# EAGLE design imu (EAGLE 5.02)
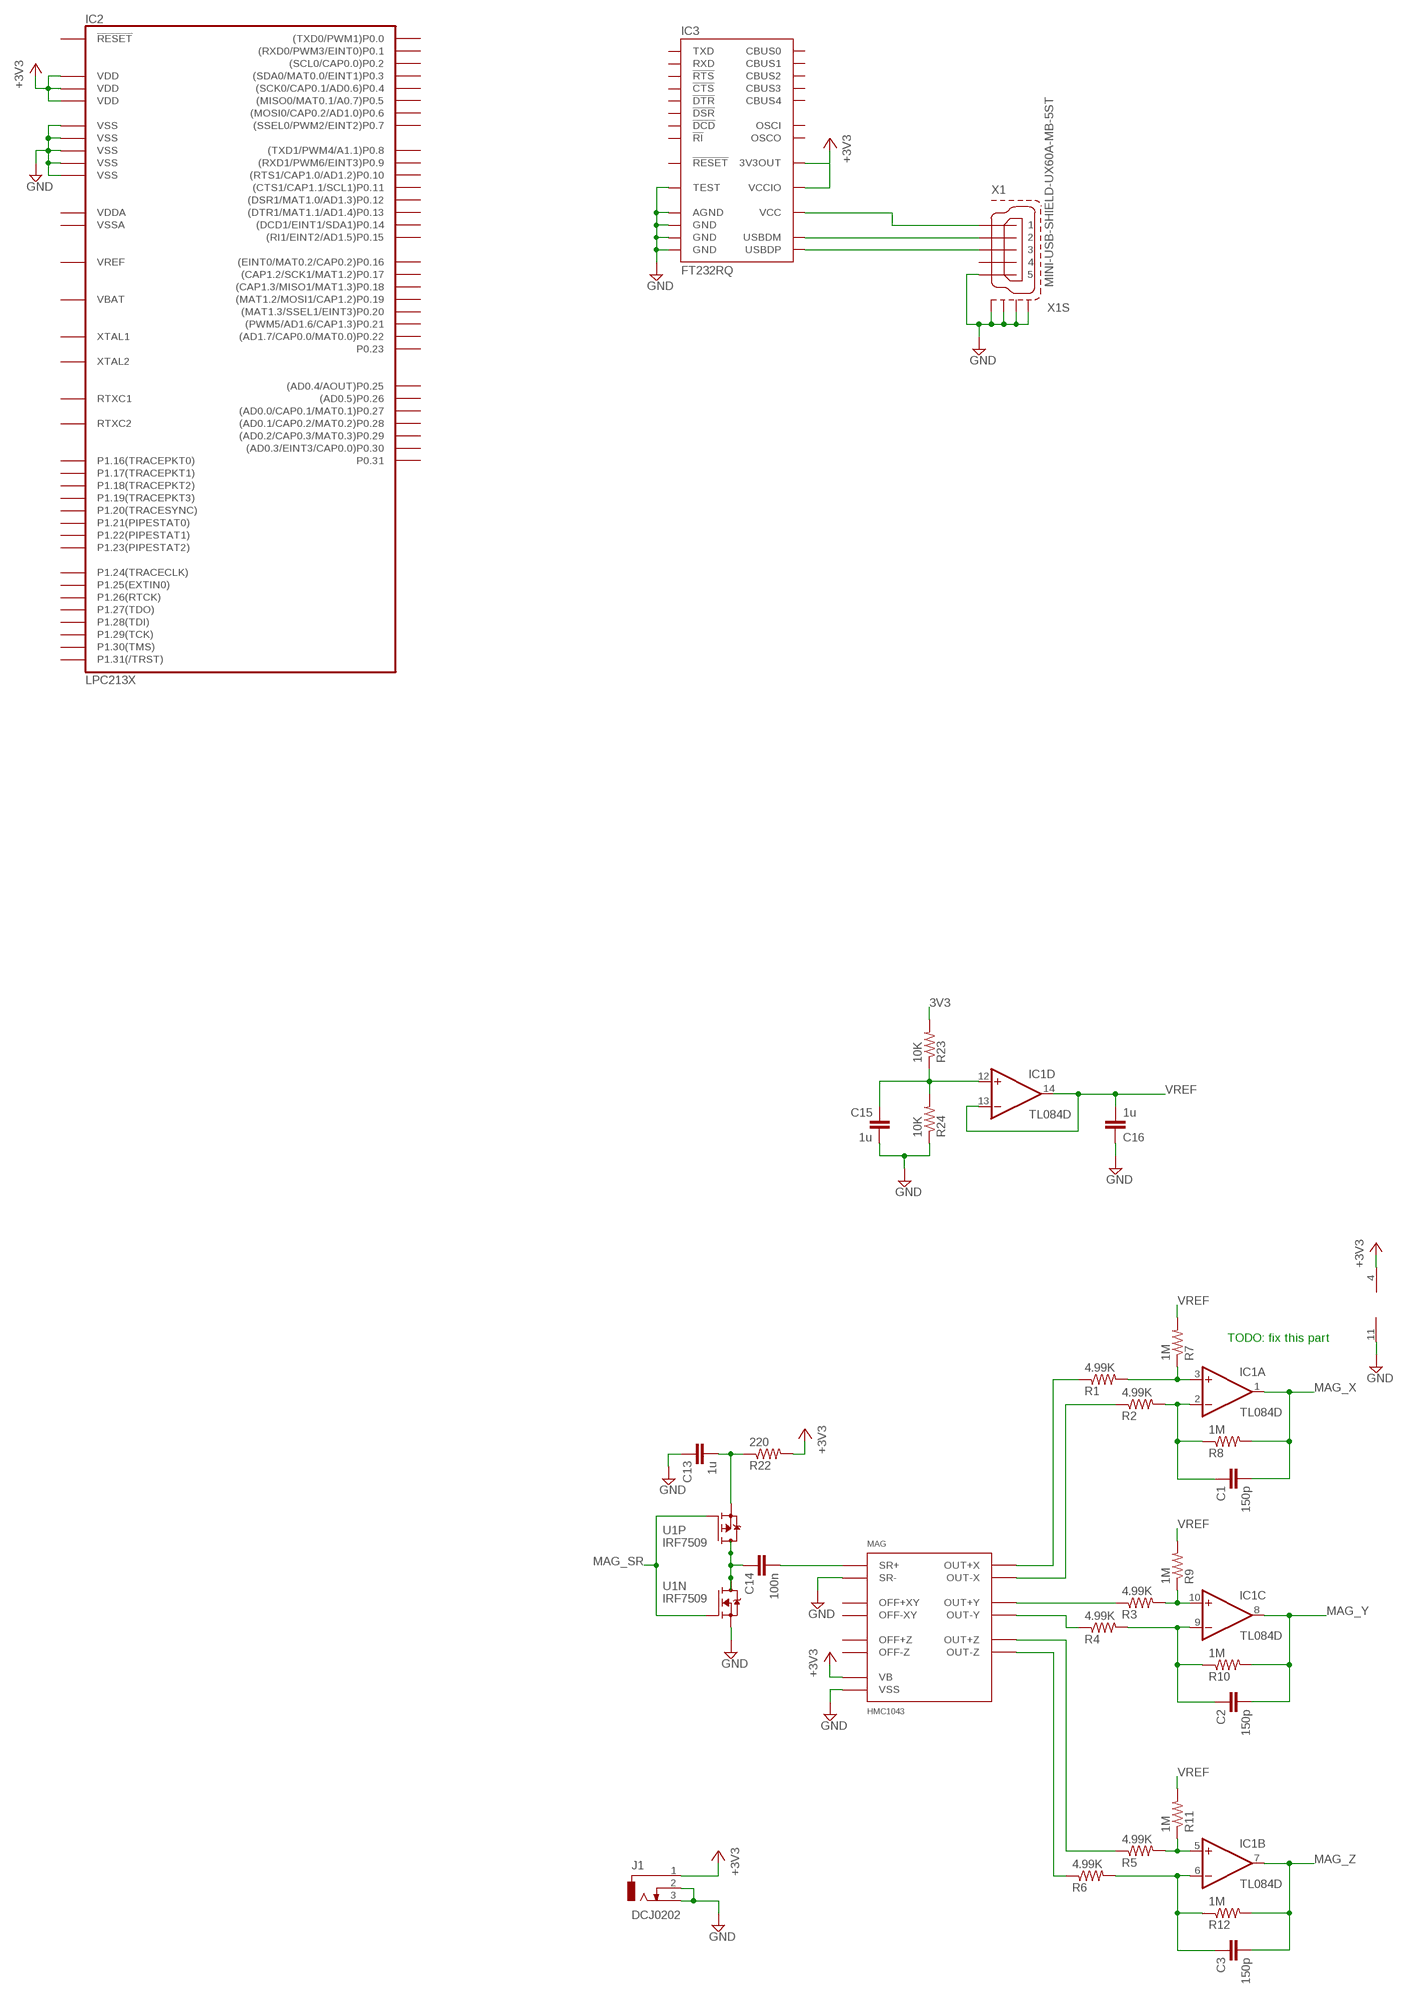
[diagram p0: schematic, sheet 1, part 1 of 2]
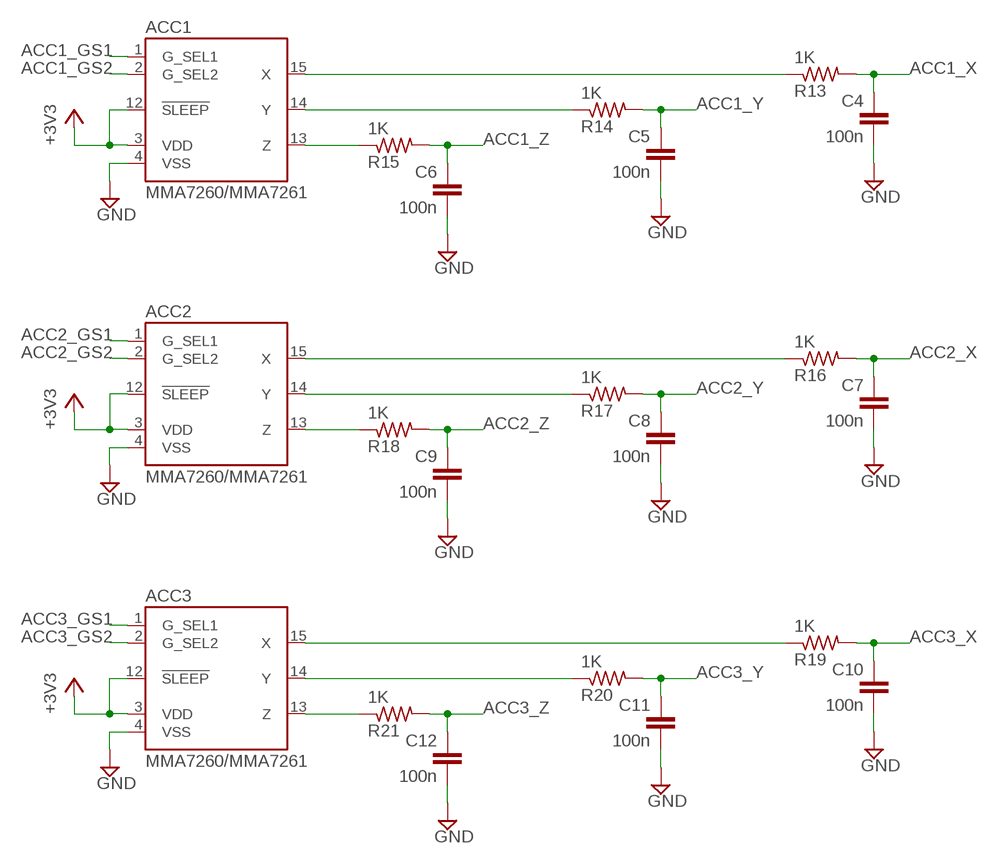
[diagram p1: schematic, sheet 1, part 2 of 2]

## Parts
ACC1  MMA7260/MMA7261  [QFN16-HS]
ACC2  MMA7260/MMA7261  [QFN16-HS]
ACC3  MMA7260/MMA7261  [QFN16-HS]
C1  150p  C-EUC0603  [C0603]
C2  150p  C-EUC0603  [C0603]
C3  150p  C-EUC0603  [C0603]
C4  100n  C-EUC0603  [C0603]
C5  100n  C-EUC0603  [C0603]
C6  100n  C-EUC0603  [C0603]
C7  100n  C-EUC0603  [C0603]
C8  100n  C-EUC0603  [C0603]
C9  100n  C-EUC0603  [C0603]
C10  100n  C-EUC0603  [C0603]
C11  100n  C-EUC0603  [C0603]
C12  100n  C-EUC0603  [C0603]
C13  1u  C-EUC0603  [C0603]
C14  100n  C-EUC0603  [C0603]
C15  1u  C-EUC0603  [C0603]
C16  1u  C-EUC0603  [C0603]
IC1  TL084D  [SO14]
IC2  LPC213X  [LQFP64]
IC3  FT232RQ  [QFN32]
J1  DCJ0202  [DCJ0202]
MAG  HMC1043  [16-PIN_LPCC]
R1  4.99K  R-US_R0603  [R0603]
R2  4.99K  R-US_R0603  [R0603]
R3  4.99K  R-US_R0603  [R0603]
R4  4.99K  R-US_R0603  [R0603]
R5  4.99K  R-US_R0603  [R0603]
R6  4.99K  R-US_R0603  [R0603]
R7  1M  R-US_R0603  [R0603]
R8  1M  R-US_R0603  [R0603]
R9  1M  R-US_R0603  [R0603]
R10  1M  R-US_R0603  [R0603]
R11  1M  R-US_R0603  [R0603]
R12  1M  R-US_R0603  [R0603]
R13  1K  R-US_R0603  [R0603]
R14  1K  R-US_R0603  [R0603]
R15  1K  R-US_R0603  [R0603]
R16  1K  R-US_R0603  [R0603]
R17  1K  R-US_R0603  [R0603]
R18  1K  R-US_R0603  [R0603]
R19  1K  R-US_R0603  [R0603]
R20  1K  R-US_R0603  [R0603]
R21  1K  R-US_R0603  [R0603]
R22  220  R-US_R0603  [R0603]
R23  10K  R-US_R0603  [R0603]
R24  10K  R-US_R0603  [R0603]
U1  IRF7509  [MICRO8]
X1  MINI-USB-SHIELD-UX60A-MB-5ST  [UX60A-MB-5ST]

## Nets
3V3: R23.2
+3V3: ACC1.3(VDD) ACC1.12(!SLEEP) ACC2.3(VDD) ACC2.12(!SLEEP) ACC3.3(VDD) ACC3.12(!SLEEP) IC1.4(P:V+) IC2.23(VDD) IC2.43(VDD) IC2.51(VDD) IC3.1(VCCIO) IC3.16(3V3OUT) J1.1 MAG.12(VB) R22.2
+5V_USB: IC3.19(VCC) X1.1
ACC1_GS1: ACC1.1(G_SEL1)
ACC1_GS2: ACC1.2(G_SEL2)
ACC1_X: C4.1 R13.2
ACC1_Y: C5.1 R14.2
ACC1_Z: C6.1 R15.2
ACC2_GS1: ACC2.1(G_SEL1)
ACC2_GS2: ACC2.2(G_SEL2)
ACC2_X: C7.1 R16.2
ACC2_Y: C8.1 R17.2
ACC2_Z: C9.1 R18.2
ACC3_GS1: ACC3.1(G_SEL1)
ACC3_GS2: ACC3.2(G_SEL2)
ACC3_X: C10.1 R19.2
ACC3_Y: C11.1 R20.2
ACC3_Z: C12.1 R21.2
GND: ACC1.4(VSS) ACC2.4(VSS) ACC3.4(VSS) C4.2 C5.2 C6.2 C7.2 C8.2 C9.2 C10.2 C11.2 C12.2 C13.1 C15.2 C16.1 IC1.11(P:V-) IC2.6(VSS) IC2.18(VSS) IC2.25(VSS) IC2.42(VSS) IC2.50(VSS) IC3.4(GND) IC3.17(GND) IC3.20(GND) IC3.24(AGND) IC3.26(TEST) J1.2 J1.3 MAG.2(VSS) MAG.7(SR-) R24.1 U1.1(N:S) X1.5 X1.M1(S1) X1.M2(S2) X1.M3(S3) X1.M4(S4)
MAG_SR: U1.2(N:G) U1.4(P:G)
MAG_X: C1.2 IC1.1(A:OUT) R8.2
MAG_Y: C2.2 IC1.8(C:OUT) R10.2
MAG_Z: C3.2 IC1.7(B:OUT) R12.2
N$1: ACC1.14(Y) R14.1
N$2: ACC2.15(X) R16.1
N$3: ACC1.15(X) R13.1
N$4: ACC2.13(Z) R18.1
N$5: ACC1.13(Z) R15.1
N$6: C2.1 IC1.9(C:-IN) R4.2 R10.1
N$7: C14.1 U1.5(P:D) U1.6(P:D) U1.7(N:D) U1.8(N:D)
N$8: ACC2.14(Y) R17.1
N$9: ACC3.15(X) R19.1
N$10: ACC3.13(Z) R21.1
N$11: ACC3.14(Y) R20.1
N$12: IC1.10(C:+IN) R3.2 R9.1
N$13: C3.1 IC1.6(B:-IN) R6.2 R12.1
N$14: IC3.15(USBDM) X1.2
N$15: IC1.5(B:+IN) R5.2 R11.1
N$16: C1.1 IC1.2(A:-IN) R2.2 R8.1
N$17: IC3.14(USBDP) X1.3
N$18: IC1.3(A:+IN) R1.2 R7.1
N$19: MAG.3(OUT+X) R1.1
N$20: MAG.15(OUT-X) R2.1
N$21: MAG.11(OUT+Z) R5.1
N$22: MAG.10(OUT-Z) R6.1
N$23: MAG.6(OUT+Y) R3.1
N$24: MAG.1(OUT-Y) R4.1
N$26: C14.2 MAG.5(SR+)
N$27: C13.2 R22.1 U1.3(P:S)
N$30: C15.1 IC1.12(D:+IN) R23.1 R24.2
VREF: C16.2 IC1.13(D:-IN) IC1.14(D:OUT) R7.2 R9.2 R11.2
Unconnected: IC2.1((PWM5/AD1.6/CAP1.3)P0.21) IC2.2((AD1.7/CAP0.0/MAT0.0)P0.22) IC2.3(RTXC1) IC2.4(P1.19(TRACEPKT3)) IC2.5(RTXC2) IC2.8(P1.18(TRACEPKT2)) IC2.9((AD0.4/AOUT)P0.25) IC2.10((AD0.5)P0.26) IC2.11((AD0.0/CAP0.1/MAT0.1)P0.27) IC2.12(P1.17(TRACEPKT1)) IC2.13((AD0.1/CAP0.2/MAT0.2)P0.28) IC2.14((AD0.2/CAP0.3/MAT0.3)P0.29) IC2.15((AD0.3/EINT3/CAP0.0)P0.30) IC2.16(P1.16(TRACEPKT0)) IC2.17(P0.31) IC2.19((TXD0/PWM1)P0.0) IC2.20(P1.31(/TRST)) IC2.21((RXD0/PWM3/EINT0)P0.1) IC2.22((SCL0/CAP0.0)P0.2) IC2.24(P1.26(RTCK)) IC2.26((SDA0/MAT0.0/EINT1)P0.3) IC2.27((SCK0/CAP0.1/AD0.6)P0.4) IC2.28(P1.25(EXTIN0)) IC2.29((MISO0/MAT0.1/A0.7)P0.5) IC2.30((MOSI0/CAP0.2/AD1.0)P0.6) IC2.31((SSEL0/PWM2/EINT2)P0.7) IC2.32(P1.24(TRACECLK)) IC2.33((TXD1/PWM4/A1.1)P0.8) IC2.34((RXD1/PWM6/EINT3)P0.9) IC2.35((RTS1/CAP1.0/AD1.2)P0.10) IC2.36(P1.23(PIPESTAT2)) IC2.37((CTS1/CAP1.1/SCL1)P0.11) IC2.38((DSR1/MAT1.0/AD1.3)P0.12) IC2.39((DTR1/MAT1.1/AD1.4)P0.13) IC2.40(P1.22(PIPESTAT1)) IC2.41((DCD1/EINT1/SDA1)P0.14) IC2.44(P1.21(PIPESTAT0)) IC2.45((RI1/EINT2/AD1.5)P0.15) IC2.46((EINT0/MAT0.2/CAP0.2)P0.16) IC2.47((CAP1.2/SCK1/MAT1.2)P0.17) IC2.48(P1.20(TRACESYNC)) IC2.52(P1.30(TMS)) IC2.53((CAP1.3/MISO1/MAT1.3)P0.18) IC2.54((MAT1.2/MOSI1/CAP1.2)P0.19) IC2.55((MAT1.3/SSEL1/EINT3)P0.20) IC2.56(P1.29(TCK)) IC2.57(!RESET) IC2.58(P0.23) IC2.60(P1.28(TDI)) IC2.61(XTAL2) IC2.62(XTAL1) IC2.64(P1.27(TDO)) IC3.2(RXD) IC3.3(!RI) IC3.6(!DSR) IC3.7(!DCD) IC3.8(!CTS) IC3.9(CBUS4) IC3.10(CBUS2) IC3.11(CBUS3) IC3.18(!RESET) IC3.21(CBUS1) IC3.22(CBUS0) IC3.27(OSCI) IC3.28(OSCO) IC3.30(TXD) IC3.31(!DTR) IC3.32(!RTS) MAG.4(OFF-XY) MAG.13(OFF-Z) MAG.14(OFF+Z) MAG.16(OFF+XY) X1.4

## Notes on the sheet
- TODO: fix this part

## Power pins joined to a net without a drawn wire
VBAT: IC2.49(VBAT)
VDDA: IC2.7(VDDA)
VREF: IC2.63(VREF)
VSSA: IC2.59(VSSA)

## Library data of the parts
ACC1-ACC3 = mma7260_7261:MMA7260/MMA7261
C1-C16 = rcl:C-EU: CAPACITOR, European symbol
IC1 = linear:TL084: OP AMP
IC2 = lpc213x:LPC213X: LPC213x Schematic element and footprint for NXP LPC213x. Spark Fun Electronics SKU : COM-00520
IC3 = ft232r:FT232R: Source: http://www.ftdichip.com/Documents/DataSheets/DS_FT232R_v104.pdf
J1 = con-jack:DCJ0202: DC POWER JACK Source: DCJ0202.pdf
MAG = hmc1043:HMC1043
R1-R24 = rcl:R-US_: RESISTOR, American symbol
U1 = irf7509:IRF7509
X1 = con-hirose:MINI-USB-SHIELD-: MINI USB Connector Source: http://www.hirose.co.jp/cataloge_hp/e24000019.pdf

## Net classes
1 power: width 0.61 mm, drill 0.711 mm, clearance 0.33 mm
2 gnd: width 0.305 mm, drill 0.711 mm, clearance 0.254 mm
3 usbvcc: width 0.508 mm, drill 0.711 mm, clearance 0.254 mm
4 aref: width 0.406 mm

## Board
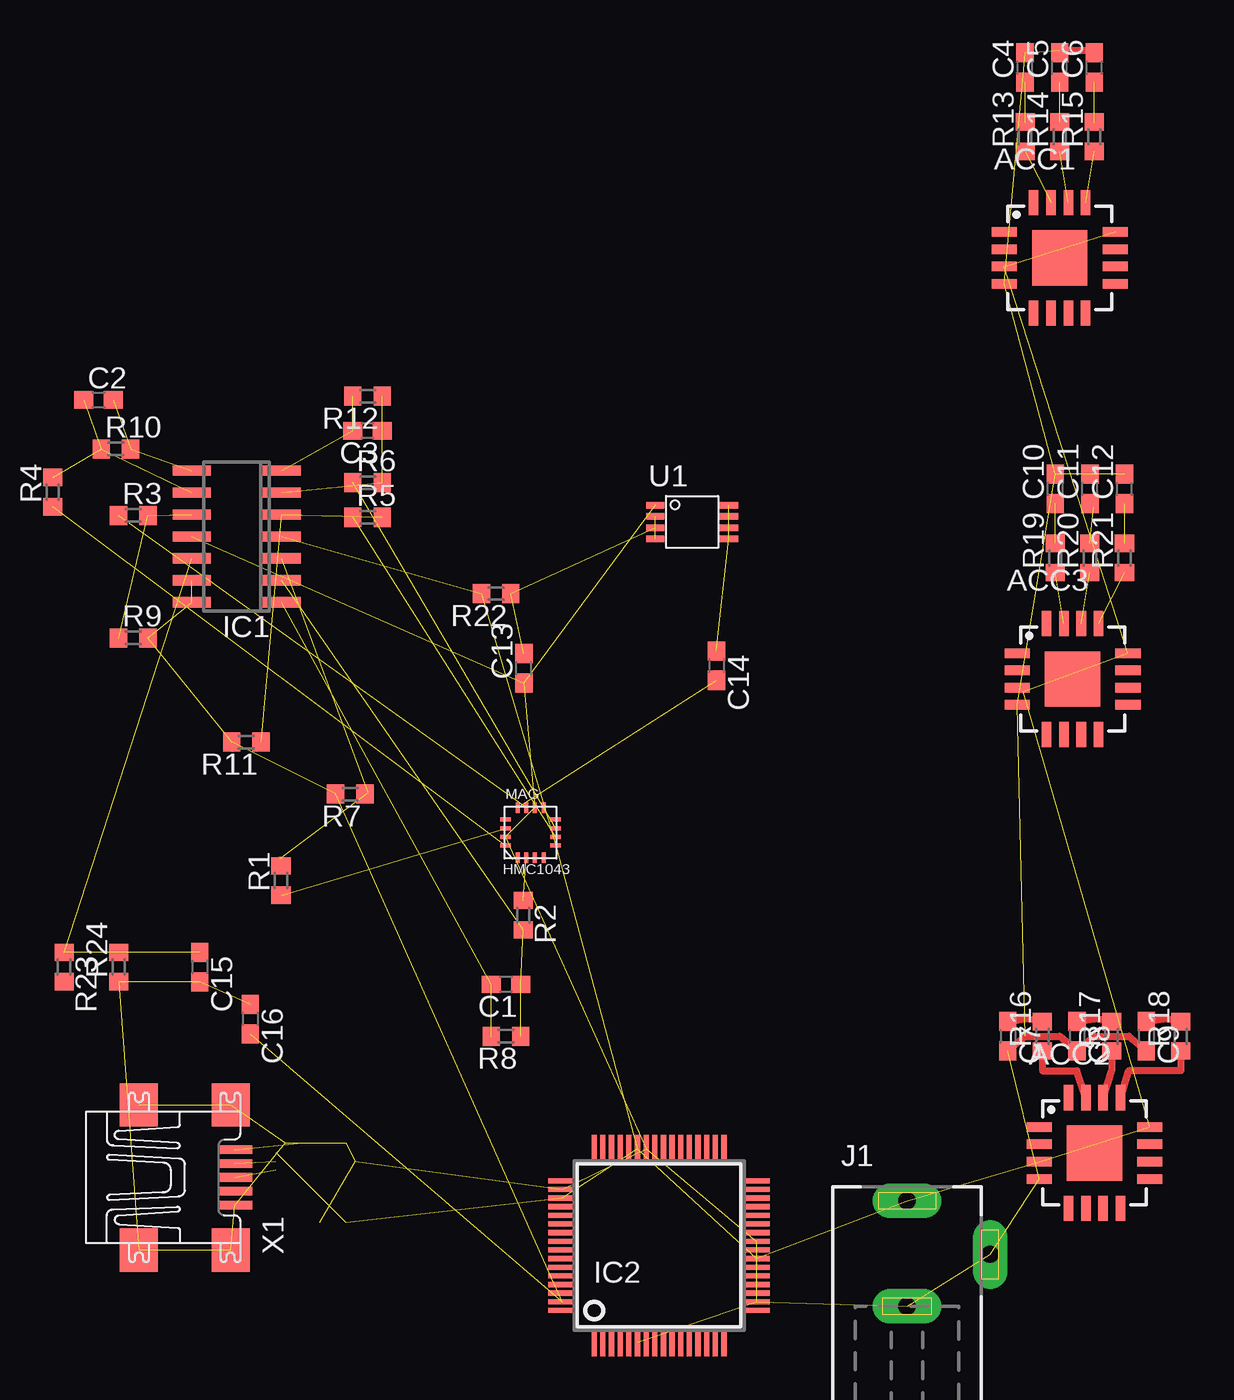
[diagram p2: board, top side]
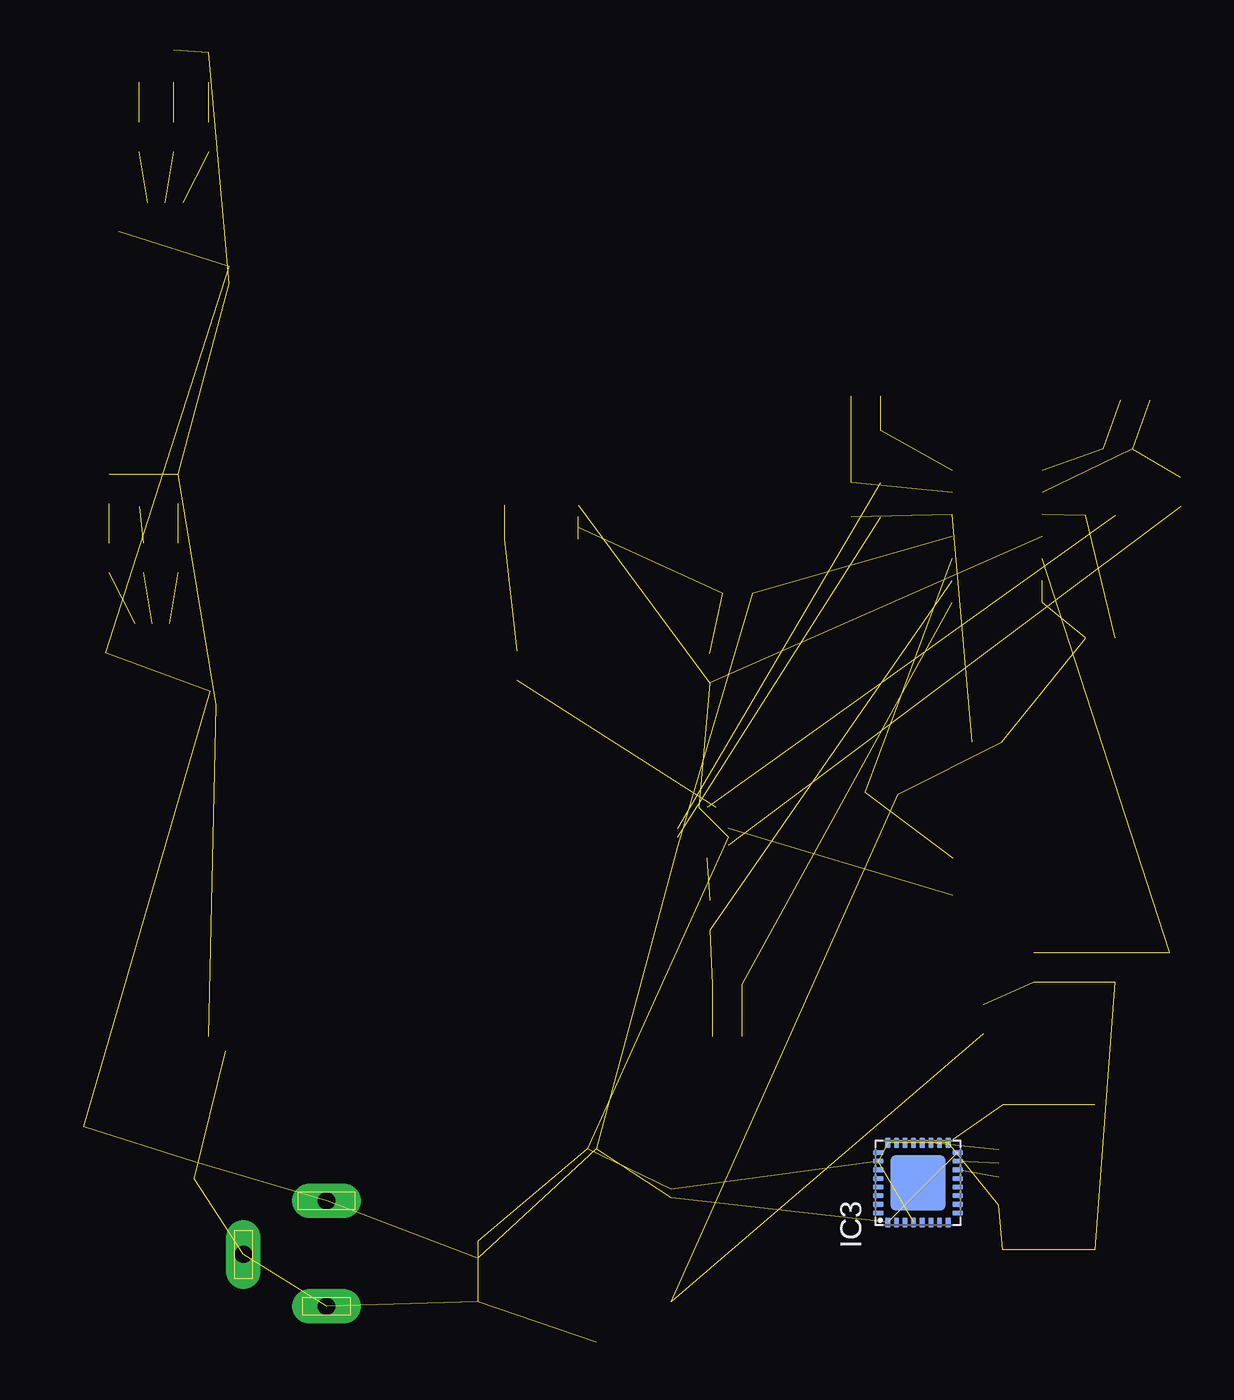
[diagram p3: board, bottom side, seen from below]

No outline drawn. Coordinates in mm, seen from the top.
Copper layers (1*16): Top 0.035mm / dielectric 1.5mm / Bottom 0.035mm
Design rules "default": minimum track width 10mil, minimum drill 24mil, track to track 8mil, track to pad 8mil, pad to pad 8mil, via to via 8mil, smd to smd 8mil, copper to edge 40mil, drill to drill 8mil, minimum pad ring 10mil, minimum via ring 8mil, stop-mask expansion 4mil, vias tented up to drill 0mil, thermal gap 10mil

### Footprints (pad centres in the part's own frame; a part is rotated, then mirrored left to right if it is on the bottom)
QFN16-HS = smd 1.45 x 0.55: 1 -3.2,1.5; 2 -3.2,0.5; 3 -3.2,-0.5; 4 -3.2,-1.5; 9 3.2,-1.5; 10 3.2,-0.5; 11 3.2,0.5; 12 3.2,1.5 | smd 0.55 x 1.45: 5 -1.5,-3.2; 6 -0.5,-3.2; 7 0.5,-3.2; 8 1.5,-3.2; 13 1.5,3.2; 14 0.5,3.2; 15 -0.5,3.2; 16 -1.5,3.2 | smd 3.2 x 3.2: 17 0,0
C0603 = smd 1.1 x 1: 1 -0.85,0; 2 0.85,0
SO14 = smd 0.6 x 2.2: 1 -3.81,-2.6; 2 -2.54,-2.6; 3 -1.27,-2.6; 4 0,-2.6; 5 1.27,-2.6; 6 2.54,-2.6; 7 3.81,-2.6; 8 3.81,2.6; 9 2.54,2.6; 10 1.27,2.6; 11 0,2.6; 12 -1.27,2.6; 13 -2.54,2.6; 14 -3.81,2.6
LQFP64 = smd 0.3 x 1.6: 1 -3.75,-5.6; 2 -3.25,-5.6; 3 -2.75,-5.6; 4 -2.25,-5.6; 5 -1.75,-5.6; 6 -1.25,-5.6; 7 -0.75,-5.6; 8 -0.25,-5.6; 9 0.25,-5.6; 10 0.75,-5.6; 11 1.25,-5.6; 12 1.75,-5.6; 13 2.25,-5.6; 14 2.75,-5.6; 15 3.25,-5.6; 16 3.75,-5.6; 33 3.75,5.6; 34 3.25,5.6; 35 2.75,5.6; 36 2.25,5.6; 37 1.75,5.6; 38 1.25,5.6; 39 0.75,5.6; 40 0.25,5.6; 41 -0.25,5.6; 42 -0.75,5.6; 43 -1.25,5.6; 44 -1.75,5.6; 45 -2.25,5.6; 46 -2.75,5.6; 47 -3.25,5.6; 48 -3.75,5.6 | smd 1.6 x 0.3: 17 5.6,-3.75; 18 5.6,-3.25; 19 5.6,-2.75; 20 5.6,-2.25; 21 5.6,-1.75; 22 5.6,-1.25; 23 5.6,-0.75; 24 5.6,-0.25; 25 5.6,0.25; 26 5.6,0.75; 27 5.6,1.25; 28 5.6,1.75; 29 5.6,2.25; 30 5.6,2.75; 31 5.6,3.25; 32 5.6,3.75; 49 -5.6,3.75; 50 -5.6,3.25; 51 -5.6,2.75; 52 -5.6,2.25; 53 -5.6,1.75; 54 -5.6,1.25; 55 -5.6,0.75; 56 -5.6,0.25; 57 -5.6,-0.25; 58 -5.6,-0.75; 59 -5.6,-1.25; 60 -5.6,-1.75; 61 -5.6,-2.25; 62 -5.6,-2.75; 63 -5.6,-3.25; 64 -5.6,-3.75
QFN32 = smd 0.6 x 0.3: 1 -2.3,1.75; 2 -2.3,1.25; 3 -2.3,0.75; 4 -2.3,0.25; 5 -2.3,-0.25; 6 -2.3,-0.75; 7 -2.3,-1.25; 8 -2.3,-1.75; 17 2.3,-1.75; 18 2.3,-1.25; 19 2.3,-0.75; 20 2.3,-0.25; 21 2.3,0.25; 22 2.3,0.75; 23 2.3,1.25; 24 2.3,1.75 | smd 0.3 x 0.6: 9 -1.75,-2.3; 10 -1.25,-2.3; 11 -0.75,-2.3; 12 -0.25,-2.3; 13 0.25,-2.3; 14 0.75,-2.3; 15 1.25,-2.3; 16 1.75,-2.3; 25 1.75,2.3; 26 1.25,2.3; 27 0.75,2.3; 28 0.25,2.3; 29 -0.25,2.3; 30 -0.75,2.3; 31 -1.25,2.3; 32 -1.75,2.3 | smd 3.2 x 3.2: EXP 0,0
DCJ0202 = drill 1 pad 2 long: 1 0,3.1; 2 4.8,0; 3 0,-3
16-PIN_LPCC = smd 0.6 x 0.23: 1 0.05,0.75; 2 0.05,1.25; 3 0.05,1.75; 4 0.05,2.25; 9 2.95,2.25; 10 2.95,1.75; 11 2.95,1.25; 12 2.95,0.75 | smd 0.23 x 0.6: 5 0.75,2.95; 6 1.25,2.95; 7 1.75,2.95; 8 2.25,2.95; 13 2.25,0.05; 14 1.75,0.05; 15 1.25,0.05; 16 0.75,0.05
R0603 = smd 1 x 1.1: 1 -0.85,0; 2 0.85,0
MICRO8 = smd 0.38 x 1.05: 1 -0.975,-2.125; 2 -0.325,-2.125; 3 0.325,-2.125; 4 0.975,-2.125; 5 0.975,2.125; 6 0.325,2.125; 7 -0.325,2.125; 8 -0.975,2.125
UX60A-MB-5ST = smd 2 x 0.5: 1 2.25,1.6; 2 2.25,0.8; 3 2.25,0; 4 2.25,-0.8; 5 2.25,-1.6 | smd 2.2 x 2.5: M1 -3.3,-4.2; M2 -3.3,4.2; M3 2,4.2; M4 2,-4.2

### Placement (x,y rotation side)
ACC1  59,69 0 top
ACC2  61.02,17.25 0 top
ACC3  59.75,44.65 0 top
C1  27,27 180 top
C2  3.46,60.79 0 top
C3  19,59 180 top
C4  57,80 90 top
C5  59,80 90 top
C6  61,80 90 top
C7  56,24 270 top
C8  60,24 270 top
C9  64,24 270 top
C10  58.75,55.65 90 top
C11  60.75,55.65 90 top
C12  62.75,55.65 90 top
C13  28.04,45.27 90 top
C14  39.16,45.43 270 top
C15  9.3,28 270 top
C16  12.22,25 270 top
IC1  11.43,52.89 90 top
IC2  35.85,11.9 0 top
IC3  16,15.53 90 bottom
J1  50.18,11.39 0 top
MAG  26.92,34.27 0 top
R1  14,33 90 top
R2  28,31 270 top
R3  5.46,54.11 0 top
R4  0.81,55.46 90 top
R5  19,54 0 top
R6  19,56 0 top
R7  18,38 180 top
R8  27,24 180 top
R9  5.46,47.03 0 top
R10  4.46,57.95 0 top
R11  12,41 180 top
R12  19,61 180 top
R13  57,76 90 top
R14  59,76 90 top
R15  61,76 90 top
R16  58,24 90 top
R17  62,24 90 top
R18  66,24 90 top
R19  58.75,51.65 90 top
R20  60.75,51.65 90 top
R21  62.75,51.65 90 top
R22  26.43,49.59 180 top
R23  1.46,28 270 top
R24  4.62,28 90 top
U1  37.76,53.73 270 top
X1  9.09,15.84 0 top

### Tracks (layer width: path | path; a pad name or v marks a point on that pad's centre or on a via)
+3V3  (14 unrouted)
  Top 0.254: ACC3.3 56.9,43.94
+5V_USB  (1 unrouted)
ACC1_X  (1 unrouted)
ACC1_Y  (1 unrouted)
ACC1_Z  (1 unrouted)
ACC2_X
  Top 0.406: C7.1 57,25 R16.2
ACC2_Y
  Top 0.406: C8.1 61,25 R17.2
ACC2_Z
  Top 0.406: C9.1 65,25 R18.2
ACC3_X  (1 unrouted)
ACC3_Y  (1 unrouted)
  Top 0.254: C11.1 60.96,54.61
ACC3_Z  (1 unrouted)
GND  (33 unrouted)
  Top 0.406: C6.2 61,81 59,81 C5.2 | C7.2 57,24 59,24 C8.2 61,24 63,24 C9.2
MAG_SR  (1 unrouted)
MAG_X  (2 unrouted)
MAG_Y  (2 unrouted)
MAG_Z  (2 unrouted)
N$1  (1 unrouted)
N$2
  Top 0.406: ACC2.15 60,22 58,22 R16.1
N$3  (1 unrouted)
N$4
  Top 0.406: ACC2.13 63,22 66,22 R18.1
N$5  (1 unrouted)
N$6  (3 unrouted)
N$7  (4 unrouted)
N$8
  Top 0.406: ACC2.14 62,22 R17.1
N$9  (1 unrouted)
N$10  (1 unrouted)
N$11  (1 unrouted)
N$12  (2 unrouted)
N$13  (3 unrouted)
N$14  (1 unrouted)
N$15  (2 unrouted)
N$16  (3 unrouted)
N$17  (1 unrouted)
N$18  (2 unrouted)
  Top 0.254: R1.2 13.97,34.29 | 19.05,38.1 R7.1
N$19  (1 unrouted)
N$20  (1 unrouted)
N$21  (1 unrouted)
N$22  (1 unrouted)
N$23  (1 unrouted)
N$24  (1 unrouted)
N$26  (1 unrouted)
N$27  (2 unrouted)
N$30  (3 unrouted)
VREF  (6 unrouted)